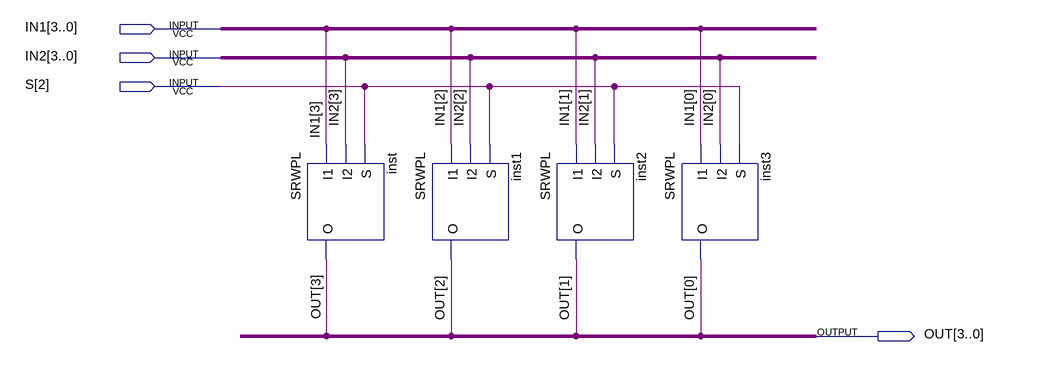
[diagram p0: schematic sheet]
// Quartus schematic 4BITMUX2.bdf as structural Verilog: 4 symbols, 4 pins
module \4BITMUX2  (
  input  [3:0] IN1,
  input  [3:0] IN2,
  input  [2:2] S,
  output [3:0] OUT
);

  SRWPL inst (.I1(IN1[3]), .I2(IN2[3]), .S(S[2]), .O(OUT[3]));
  SRWPL inst1 (.I1(IN1[2]), .I2(IN2[2]), .S(S[2]), .O(OUT[2]));
  SRWPL inst2 (.I1(IN1[1]), .I2(IN2[1]), .S(S[2]), .O(OUT[1]));
  SRWPL inst3 (.I1(IN1[0]), .I2(IN2[0]), .S(S[2]), .O(OUT[0]));
endmodule
